# Altium schematic sheet STB_eFuse.SchDoc: STB Control Board - eFuse
size A4; Author: mayerph; DrawnBy: mayerph; Organization: PBL; Revision: B; SheetNumber: 3; SheetTotal: 6
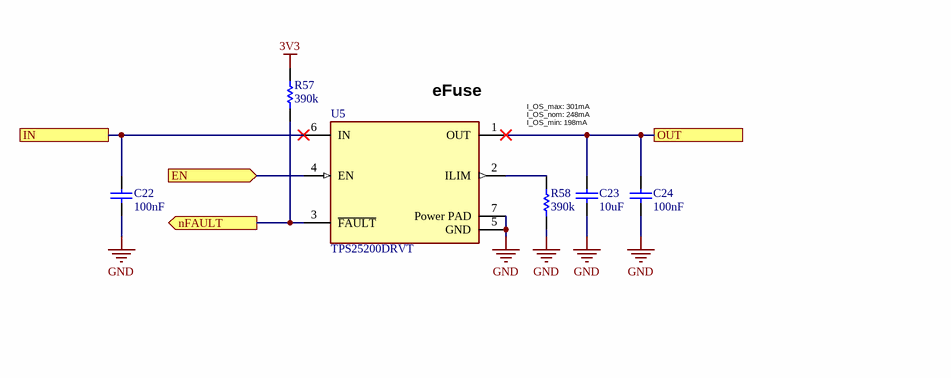
[diagram p0: STB_eFuse.SchDoc]

## Parts
C22  100nF  [CAPC1050X55X23LL05T13]
C23  10uF  [CAPC0603(1608)100_L]
C24  100nF  [CAPC1050X55X23LL05T13]
R57  390k  [RESC1005X40X25LL05T05]
R58  390k  [RESC1005X40X25LL05T05]
U5  TPS25200DRVT  [FP-DRV0006A-MFG]

## Ports
EN (in, see STB_ControlBoard[7B]), IN (see STB_ControlBoard[7B]), nFAULT (out, see STB_ControlBoard[7B]), OUT (see STB_ControlBoard[8B])

## Nets
3V3: R57.2
GND: C22.1 C23.1 C24.1 R58.1 U5.5(GND) U5.7(Power_PAD)
EN: U5.4(EN) ; port EN
IN: C22.2 U5.6(IN) ; port IN
nFAULT: R57.1 U5.3(~{FAULT}) ; port nFAULT
OUT: C23.2 C24.2 U5.1(OUT) ; port OUT
NetR58_2: R58.2 U5.2(ILIM)

## Notes on the sheet
- (near U5) eFuse
- I_OS_max: 301mA
  I_OS_nom: 248mA
  I_OS_min: 198mA
- 1
- 2
- 3
- 4
- A
- B
- C
- Project:
- D
- Date:
- Drawing number:
- Rev:
- Format:
- A4 Q
- Drawn by:
- Laboratory:
- Page
- Sheet:
- of
- File:

## Library data of the parts
C22 C24 = CMP-2000-05439-1: Chip Capacitor, 100 nF, +/- 10%, 16 V, -55 to 125 degC, 0402 (1005 Metric), RoHS, Tape and Reel; Manufacturer: Samsung Electro-Mechanics; Manufacturer Part Number: CL05B104KO5NNNC; Dielectric: X7R; Rated Voltage: 16V; Dielectric Material: Ceramic; Multilayer: Yes; Case Size/Dimension: 0402; Tolerance (%): ±10%; Value: 100nF; Manufacturer URL: http://www.samsungsem.com/global/index.jsp; Datasheet URL: https://datasheet.ciiva.com/29198/458718-da-01-en-vs-kondensator-0402-29198423.pdf; Datasheet Version: Nov-10; Supplier 1: Digi-Key; Supplier Part Number 1: 1276-1001-6-ND; RoHS: Yes; Category: Ceramic Capacitors; Stock 1: 24854634; Pricing 1: 1=0.10000, 10=0.02400, 50=0.01300, 100=0.01050, 500=0.00752, 1000=0.00592, 2500=0.00538, 5000=0.00495 (USD); Mount: Surface Mount; Number of Pins: 2; Package Shape: Rectangular; Size Code: 0402; Terminal Finish: Nickel; Min Operating Temperature: -55°C; Max Operating Temperature: 125°C; JESD-609 Code: e3; Capacitor Type: Ceramic; Negative Tolerance: 10%; Packaging: Tape and Reel; Positive Tolerance: 10%; Rated DC Voltage (URdc): 16V; Temperature Characteristics Code: X7R; Termination: Wraparound; Package Style: SMTMeter; Length: 1mm; Width: 0.5mm; Height: 0.55mm; REACH SVHC: Yes; RoHS Compliant: Yes; ComponentLink1URL: https://datasheet.ciiva.com:443/pdfs/VipMasterIC/IC/SEMS/SEMS-S-A0008384515/SEMS-S-A0008872921-1.pdf?src-supplier=IHS+Markit; ComponentLink1Description: https://datasheet.ciiva.com:443/pdfs/VipMasterIC/IC/SEMS/SEMS-S-A0008384515/SEMS-S-A0008872921-1.pdf?src-supplier=IHS+Markit; ComponentLink2URL: https://datasheet.ciiva.com/26920/getdatasheetpartid-359683-26920169.pdf?src-supplier=Verical; ComponentLink2Description: https://datasheet.ciiva.com/26920/getdatasheetpartid-359683-26920169.pdf?src-supplier=Verical; ComponentLink3URL: https://datasheet.ciiva.com/29198/458718-da-01-en-vs-kondensator-0402-29198423.pdf?src-supplier=Conrad; ComponentLink3Description: https://datasheet.ciiva.com/29198/458718-da-01-en-vs-kondensator-0402-29198423.pdf?src-supplier=Conrad; ComponentLink4URL: https://datasheet.ciiva.com/26309/mlcc-catalogdownload2013-eng-26309003.pdf?src-supplier=Distrelec; ComponentLink4Description: https://datasheet.ciiva.com/26309/mlcc-catalogdownload2013-eng-26309003.pdf?src-supplier=Distrelec; ComponentLink5URL: https://datasheet.ciiva.com/16208/cl05b104kq5nnnc-16208343.pdf?src-supplier=Future+Electronics; ComponentLink5Description: https://datasheet.ciiva.com/16208/cl05b104kq5nnnc-16208343.pdf?src-supplier=Future+Electronics
C23 = CMP-1035-02799-1: CAP 10uF 10V ±10% 0603 (1608 Metric) Thickness 1mm SMD; Manufacturer: Samsung; Manufacturer Part Number: CL10A106MP8NNNC; Tolerance: Â±10%; Case-Metric: 1608; Case-EIA: 0603; Dielectric: X5R; Max Thickness: 1 mm; Technology: SMT; Rated Voltage: 10 V; Value: 10uF; Supplier 1: Digi-Key; Supplier Part Number 1: 1276-1871-1-ND; RoHS: Yes; Category: Ceramic Capacitors; Stock 1: 643992; Pricing 1: 1=0.26000, 10=0.17600, 50=0.10580, 100=0.08930, 500=0.06112, 1000=0.05407 (USD); Mount: Surface Mount; Case/Package: 0603; Case Code (Imperial): 0603; Case Code (Metric): 1608; Contact Plating: Tin; Min Operating Temperature: -55°C; Max Operating Temperature: 85°C; Packaging: Tape and Reel; Capacitance: 10uF; Voltage Rating: 10V; Voltage Rating (DC): 10V; Package Quantity: 1; Length: 1.6mm; Width: 0.031inch; Height: 0.8mm; Thickness: 0.035inch; Depth: 0.8mm; Radiation Hardening: No; Lead Free: Lead Free; ComponentLink1URL: https://datasheet.ciiva.com/25793/cl10a106mp8nnnc-25793222.pdf?src-supplier=Digi-Key; ComponentLink1Description: https://datasheet.ciiva.com/25793/cl10a106mp8nnnc-25793222.pdf?src-supplier=Digi-Key; ComponentLink2URL: https://datasheet.ciiva.com/16200/cl10a106mp8nnnc-16200411.pdf?src-supplier=Future+Electronics; ComponentLink2Description: https://datasheet.ciiva.com/16200/cl10a106mp8nnnc-16200411.pdf?src-supplier=Future+Electronics; ComponentLink3URL: https://datasheet.ciiva.com/26946/getdatasheetpartid-357531-26946980.pdf?src-supplier=Verical; ComponentLink3Description: https://datasheet.ciiva.com/26946/getdatasheetpartid-357531-26946980.pdf?src-supplier=Verical
R57 R58 = CMP-2002-01150-1: Part Number: ERJ2RKF3903X; Manufacturer: Panasonic; Manufacturer Part Number: ERJ-2RKF3903X; Tolerance: 1%; Rated Power Dissipation (P): 100mW; Value: 390 kOhm; Temperature Coefficient: 100ppm/°C; Working Voltage: 50V; Rated Temperature: 70°C; Package Height: 0.35mm; Package Length: 1mm; Package Width: 0.5mm; Reference Standard: AEC-Q200; Supplier 1: Digi-Key; Supplier Part Number 1: P390KLDKR-ND; RoHS: Yes; Category: Chip SMD Resistors; Stock 1: 16645; Pricing 1: 1=0.10000, 10=0.03300, 100=0.01330, 1000=0.00599, 2500=0.00520, 5000=0.00429 (USD); Mount: Surface Mount; Number of Pins: 2; Size Code: 0402; Terminal Finish: Nickel; Package Shape: Rectangular; Min Operating Temperature: -55°C; Max Operating Temperature: 155°C; JESD-609 Code: e3; Resistor Type: FIXED RESISTOR; Technology: METAL GLAZE/THICK FILM; Construction: Rectangular; Package Style: SMTMeter; Packaging: Tape and Reel; Termination: Wraparound; REACH SVHC: Yes; RoHS Compliant: Yes; ComponentLink1URL: https://datasheet.ciiva.com:443/pdfs/VipMasterIC/IC/PANA/PANA-S-A0009889626/PANA-S-A0009889626-1.pdf?src-supplier=IHS+Markit; ComponentLink1Description: https://datasheet.ciiva.com:443/pdfs/VipMasterIC/IC/PANA/PANA-S-A0009889626/PANA-S-A0009889626-1.pdf?src-supplier=IHS+Markit; ComponentLink2URL: https://datasheet.ciiva.com/11821/0900766b80f80784-11821283.pdf?src-supplier=RSComponents; ComponentLink2Description: https://datasheet.ciiva.com/11821/0900766b80f80784-11821283.pdf?src-supplier=RSComponents; ComponentLink3URL: https://datasheet.ciiva.com/16764/70260748-16764280.pdf?src-supplier=Allied+Electronics; ComponentLink3Description: https://datasheet.ciiva.com/16764/70260748-16764280.pdf?src-supplier=Allied+Electronics; ComponentLink4URL: https://datasheet.ciiva.com/9182/aoa0000ce2-9182363.pdf?src-supplier=Avnet; ComponentLink4Description: https://datasheet.ciiva.com/9182/aoa0000ce2-9182363.pdf?src-supplier=Avnet; ComponentLink5URL: https://datasheet.ciiva.com/22681/1678782-22681165.pdf?src-supplier=Element14; ComponentLink5Description: https://datasheet.ciiva.com/22681/1678782-22681165.pdf?src-supplier=Element14; ComponentLink6URL: https://datasheet.ciiva.com/46373/1678782-46373573.pdf?src-supplier=Element14; ComponentLink6Description: https://datasheet.ciiva.com/46373/1678782-46373573.pdf?src-supplier=Element14; ComponentLink7URL: https://datasheet.ciiva.com/7711/1678782-7711046.pdf?src-supplier=Element14; ComponentLink7Description: https://datasheet.ciiva.com/7711/1678782-7711046.pdf?src-supplier=Element14; ComponentLink8URL: https://datasheet.ciiva.com/9182/aoa0000ce2-9182360.pdf?src-supplier=Avnet; ComponentLink8Description: https://datasheet.ciiva.com/9182/aoa0000ce2-9182360.pdf?src-supplier=Avnet; ComponentLink9URL: https://datasheet.ciiva.com/24025/aoa0000ce2-24025100.pdf?src-supplier=Mouser; ComponentLink9Description: https://datasheet.ciiva.com/24025/aoa0000ce2-24025100.pdf?src-supplier=Mouser; ComponentLink10URL: https://datasheet.ciiva.com/16785/70260748-16785997.pdf?src-supplier=Allied+Electronics; ComponentLink10Description: https://datasheet.ciiva.com/16785/70260748-16785997.pdf?src-supplier=Allied+Electronics; ComponentLink11URL: https://datasheet.ciiva.com/30263/aoa0000ce2-30263919.pdf?src-supplier=Onlinecomponents.com; ComponentLink11Description: https://datasheet.ciiva.com/30263/aoa0000ce2-30263919.pdf?src-supplier=Onlinecomponents.com
U5 = CMP-04913-000017-1: IC PWR MGR EFUSE 6.5V 2.8A 6SON; Manufacturer: Texas Instruments; Min Supply Voltage: 2.5V; Number of Channels: 1; Current: 2.5A; Package Body Material: Plastic; Supply Voltage-Nom (Vsup): 5V; Adjustable Threshold: Yes; Analog IC - Other Type: POWER SUPPLY SUPPORT CIRCUIT; Max Operating Temperature: 125°C; Min Operating Temperature: -40°C; Voltage: 6.5V; Number of Outputs: 1; Lead Free: Lead Free; Contact Plating: Gold; Packaging: Cut Tape; Max Supply Voltage: 6.5V; REACH SVHC: No SVHC; Height: 0.75mm; Length: 2.1mm; RoHS Compliant: Yes; Features: Auto Retry; Mount: Surface Mount; Width: 2.1mm; Number of Pins: 6; Max Output Current: 2.5A; Supplier 1: Digi-Key; Supplier Part Number 1: 296-37760-6-ND; Manufacturer Part Number: TPS25200DRVT; RoHS: Yes; Category: Hot Swap Controllers; Stock 1: 21750; Pricing 1: 1=1.15000, 10=1.03200, 25=0.97960, 100=0.80450 (USD); Package Code: HVSON; Package Shape: Square; Terminal Finish: Nickel; JESD-609 Code: e4; Moisture Sensitivity Level: 2; Number of Functions: 1; Package Style: SMALL OUTLINE, HEAT SINK/SLUG, VERY THIN PROFILEMeter; Supply Voltage-Max (Vsup): 6.5V; Supply Voltage-Min (Vsup): 2.5V; Surface Mount: Yes; Terminal Form: No Lead; Terminal Position: DUAL; JESD-30 Code: S-PDSO-N6; Peak Reflow Temperature (Cel): 260°C; Height - Seated (Max): 0.8mm; Terminal Pitch: 0.65mm; Temperature Grade: AUTOMOTIVE; ComponentLink1URL: https://www.ti.com:443/lit/ds/symlink/tps25200.pdf?src-supplier=IHS+Markit; ComponentLink1Description: https://www.ti.com:443/lit/ds/symlink/tps25200.pdf?src-supplier=IHS+Markit; ComponentLink2URL: https://datasheet.ciiva.com/46433/1821153-46433335.pdf?src-supplier=Element14; ComponentLink2Description: https://datasheet.ciiva.com/46433/1821153-46433335.pdf?src-supplier=Element14